# Altium schematic sheet Boost Convertor V2 Schematic.SchDoc
size A4; SheetNumber: 1; SheetTotal: 1
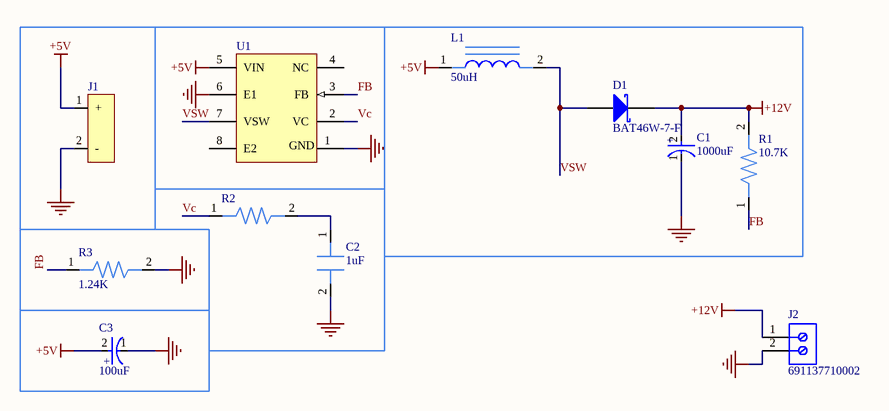
[diagram p0: Boost Convertor V2 Schematic.SchDoc]

## Parts
C1  value 1000uF  [25PX1000MEFCT810X16]  (hidden comment: 16ZLH1000MEFC10X16)
C2  value 1uF  [C1210C105K5RACTU]  (hidden comment: CL10B105KA8NNNC)
C3  value 100uF  [35ZLH100MEFC6.3X11]  (hidden comment: 35ZLH100MEFC6.3X11)
D1  BAT46W-7-F  [DIOD-SOD-123-2_V]
J1  0022013037  (value not drawn)
J2  691137710002  [691137710002]
L1  value 50uH  [CTX50-1-52-R]  (hidden comment: CTX50-1-52-R)
R1  value 10.7K  [RC0805FR-0710K7L]  (hidden comment: RC0805FR-0710K7L)
R2  (no value)  [RC0805FR-071KL]
R3  value 1.24K  [RC0805FR-071K24L]  (hidden comment: RC0805FR-071K24L)
U1  LT1172CN8#PBF  [LT1172CN8#PBF-ND]  (value not drawn)

## Nets
+5V: C3.2(A) J1.1(+) L1.1 U1.5(VIN)
+12V: C1.2(A) D1.2(K) J2.1 R1.2
GND: C1.1(C) C2.2 C3.1(C) J1.2(-) J2.2 R3.2 U1.6(E1)
FB: R1.1 R3.1 U1.3(FB)
Vc: R2.1 U1.2(VC)
VSW: D1.1(A) L1.2 U1.7(VSW)
NetC2_1: C2.1 R2.2

Not connected (* = marked no-connect by the designer): U1 1(GND) 4(NC) 8(E2)

## Notes on the sheet
- (in symbol 16ZLH1000MEFC10X16) +
- (in symbol a00bbbee19879c290e62620ae7e47b1) +

## Library data of the parts
C1 = 16ZLH1000MEFC10X16: Aluminum Electrolytic Capacitor, Polarized, Aluminum (wet), 16V, 20% +Tol, 20% -Tol, 1000uF, Through Hole Mount; Manufacturer: Rubycon; Manufacturer Series: ZLH; Dielectric Material: Aluminium; Leakage Current: 160uA; Ripple Current: 1.056A; Tan Delta: 0.16; Supplier: Digikey; Supplier Part Number: 1189-1147-ND; Manufacturer Part Number: 16ZLH1000MEFC10X16; RoHS: Yes; Category: Aluminum Electrolytic Capacitors; Stock: 32532; Pricing: 1=0.61, 10=0.377, 50=0.2812, 100=0.2505, 500=0.19778, 1000=0.18113, 3000=0.16029, 5000=0.1525 (USD); Mounting Technology: Through Hole; Pins: 2; Package Shape: Cylindrical; Min Operating Temperature: -40°C; Max Operating Temperature: 105°C; Polarity: Polarized; Capacitor Type: Aluminium; Tolerance  (fill in as +-): 20%; Package Style: RadialMeter; Packaging: Bulk; Tolerance (fill in as +-): 20%; Rated DC Voltage (URdc): 16V; Termination: Wire; Diameter: 10mm; Length: 16mm; Terminal Pitch: 5mm; Reach SVHC Compliant: Yes; RoHS Compliant: Yes; ComponentLink1URL: https://datasheet.ciiva.com:443/pdfs/VipMasterIC/IC/RUBY/RUBYS01453/RUBYS01453-1.pdf?src-supplier=IHS+Markit; ComponentLink1Description: https://datasheet.ciiva.com:443/pdfs/VipMasterIC/IC/RUBY/RUBYS01453/RUBYS01453-1.pdf?src-supplier=IHS+Markit; ComponentLink2URL: https://datasheet.ciiva.com/6300/e-zlh-6300460.pdf?src-supplier=Digikey; ComponentLink2Description: https://datasheet.ciiva.com/6300/e-zlh-6300460.pdf?src-supplier=Digikey; ComponentLink3URL: https://datasheet.ciiva.com/11692/e-zlh-11692166.pdf?src-supplier=Avnet; ComponentLink3Description: https://datasheet.ciiva.com/11692/e-zlh-11692166.pdf?src-supplier=Avnet; ComponentLink4URL: https://datasheet.ciiva.com/16313/e-zlh-16313390.pdf?src-supplier=Future+Electronics; ComponentLink4Description: https://datasheet.ciiva.com/16313/e-zlh-16313390.pdf?src-supplier=Future+Electronics; ComponentLink5URL: https://datasheet.ciiva.com/22732/1910927-22732477.pdf?src-supplier=Element14; ComponentLink5Description: https://datasheet.ciiva.com/22732/1910927-22732477.pdf?src-supplier=Element14
C2 = CL10B105KA8NNNC: Ceramic Capacitor 1uF; Manufacturer: KEMET; Manufacturer Part Number: ESL105M100AC3AA; Capacitor Type: Aluminium; Supplier: Digikey; Supplier Part Number: 399-15737-ND; RoHS: Yes; Stock: 14632; Pricing: 1=0.15, 10=0.095, 50=0.0708, 100=0.0633, 500=0.04972, 1000=0.04522, 2500=0.04024, 5000=0.03706 (USD); Pins: 2; Reach SVHC Compliant: Yes; RoHS Compliant: Yes; ComponentLink1URL: https://datasheet.ciiva.com:443/pdfs/VipMasterIC/IC/KEME/KEME-S-A0008958449/KEME-S-A0008958449-1.pdf?src-supplier=IHS+Markit; ComponentLink1Description: https://datasheet.ciiva.com:443/pdfs/VipMasterIC/IC/KEME/KEME-S-A0008958449/KEME-S-A0008958449-1.pdf?src-supplier=IHS+Markit; ComponentLink2URL: https://api.kemet.com/component-edge/download/datasheet/ESL105M100AC3AA.pdf?src-supplier=Digikey; ComponentLink2Description: https://api.kemet.com/component-edge/download/datasheet/ESL105M100AC3AA.pdf?src-supplier=Digikey; ComponentLink3URL: https://datasheet.octopart.com/ESL105M100AC3AA-KEMET-datasheet-176335207.pdf?src-supplier=Newark; ComponentLink3Description: https://datasheet.octopart.com/ESL105M100AC3AA-KEMET-datasheet-176335207.pdf?src-supplier=Newark; Supplier 1: Avnet; Supplier Part Number 1: CL10B105KA8NNNC
C3 = a00bbbee19879c290e62620ae7e47b1: CAP ALUM 100UF 20% 35V RADIAL; Lead Diameter: 0.5mm; Leakage Current: 3uA; Ripple Current (AC): 540mA; Life (Hours): 6000Hour; Dielectric Material: Aluminium; Impedance: 94mR; Number of Pins: 2; Voltage: 35V; Case/Package: Radial; Min Operating Temperature: -40°C; Height - Seated (Max): 0.492inch; Height: 11mm; Tolerance: 20%; REACH SVHC: No SVHC; Series: ZLH; Radiation Hardening: No; Ripple Current: 540mA; Package Quantity: 2000; Max Operating Temperature: 105°C; Lead Pitch: 2.5mm; Termination: Radial; Voltage Rating: 35V; Diameter: 6.3mm; Packaging: Bulk; Construction: RADIAL; Voltage Rating (DC): 35V; Mount: Through Hole; RoHS Compliant: Yes; Capacitance: 100uF
D1 = CMP-0303-00004-1: Surface Mount Schottky Barrier Diode, 100 V, -55 to 125 degC, 2-Pin SOD123, RoHS, Tape and Reel; Manufacturer: Diodes Inc; IR@1.5 V: 0.3 uA Max.; V(BR)R: 100 V Min.; VF@10 mA: 0.45 V Max.; CT@1 V: 12 pF Typ.; PartNumber: BAT46W-7-F; ComponentLink1URL: http://www.diodes.com/; ComponentLink3URL: http://diodes.com/datasheets/ds30044.pdf; PackageDescription: 2-Pin SMD, Body 2.7 x 1.55 mm, Height 1.45 mm; ComponentLink2Description: Datasheet; ComponentLink3Description: Package Specification; Mounting Technology: Surface Mount; ComponentLink1Description: Manufacturer URL; RoHS: TRUE; Operating Temperature: -55 to 125 degC; Packing: Tape and Reel; ComponentLink2URL: http://diodes.com/datasheets/ds30044.pdf; DatasheetVersion: Rev. 16-2
J1 = Molex Connector
J2 = CMP-1502-03324-2: NexarPartId: 78871135; Voltage Rating: 300V; Number of Contacts: 2; Current Rating: 16A; Lead Pitch: 5mm; Height: 11.6mm; Packaging: Box; RoHS: Non-Compliant; Contact Material: Nickel, Tin; Max Operating Temperature: 120°C; Number of Pins: 2; Min Operating Temperature: -30°C; Number of Rows: 1
L1 = CTX50-1-52-R: General Purpose Inductor, 50uH, 1 Element, Iron-Core; Manufacturer: Eaton Cooper; Core Material: Ferrite; DC Resistance (DCR): 71.5mR; Inductor Application: POWER INDUCTOR; Channels: 1; Max Current Rating: 2.6A; Shape/Size Description: CYLINDRICAL PACKAGE; Shielding: Unshielded; Surface Mount: No; Lead Diameter: 0.58mm; Lead Length: 10mm; Package Diameter: 16.2mm; Package Length: 9mm; Supplier: Digikey; Supplier Part Number: 513-1108-ND; Manufacturer Part Number: CTX50-1-52-R; RoHS: Yes; Category: Fixed Inductors; Stock: 1049; Pricing: 1=2.67, 10=2.196, 25=2.0312, 50=1.915, 100=1.8057, 300=1.6451, 600=1.55137, 1200=1.46311, 2700=1.36639 (USD); Pins: 2; Min Operating Temperature: -40°C; Max Operating Temperature: 75°C; Construction: Vertical Mount; Inductance-Nom (L): 50uH; Inductor Type: GENERAL PURPOSE INDUCTOR; Package Style: ToroidalMeter; Packaging: Bulk; Terminal Placement: Radial; Termination: Wire; Lead Pitch: 7.5mm; Reach SVHC Compliant: Yes; RoHS Compliant: Yes; ComponentLink1URL: https://datasheet.ciiva.com:443/pdfs/VipMasterIC/IC/ETON/ETON-S-A0008259577/ETON-S-A0008259577-1.pdf?src-supplier=IHS+Markit; ComponentLink1Description: https://datasheet.ciiva.com:443/pdfs/VipMasterIC/IC/ETON/ETON-S-A0008259577/ETON-S-A0008259577-1.pdf?src-supplier=IHS+Markit; ComponentLink2URL: https://datasheet.ciiva.com/8005/705007-8005134.pdf?src-supplier=Element14; ComponentLink2Description: https://datasheet.ciiva.com/8005/705007-8005134.pdf?src-supplier=Element14; ComponentLink3URL: https://datasheet.ciiva.com/16430/bus-elx-ds-pm4304-lpci-series-16430805.pdf?src-supplier=Future+Electronics; ComponentLink3Description: https://datasheet.ciiva.com/16430/bus-elx-ds-pm4304-lpci-series-16430805.pdf?src-supplier=Future+Electronics; ComponentLink4URL: https://datasheet.ciiva.com/30168/4935b080188143dbb73de2176f2c5e73-30168168.pdf?src-supplier=Onlinecomponents.com; ComponentLink4Description: https://datasheet.ciiva.com/30168/4935b080188143dbb73de2176f2c5e73-30168168.pdf?src-supplier=Onlinecomponents.com
R1 = RC0805FR-0710K7L: Fixed Resistor, Metal Film, 0.25W, 10700ohm, 250V, 1% +/-Tol, -100,100ppm/Cel; Manufacturer: Yageo; Manufacturer Part Number: MFR-25FBF52-10K7; Supplier: Digikey; Supplier Part Number: 10.7KXBK-ND; RoHS: Yes; Category: Through-Hole Resistors; Stock: 6622; Pricing: 1=0.1, 10=0.039, 25=0.0328, 50=0.0286, 100=0.0251, 250=0.02128, 500=0.0189, 1000=0.01685, 5000=0.01321 (USD); ComponentLink1URL: https://datasheet.ciiva.com:443/pdfs/VipMasterIC/IC/YAGO/YAGO-S-A0009358480/YAGO-S-A0009358480-1.pdf?src-supplier=IHS+Markit; ComponentLink1Description: https://datasheet.ciiva.com:443/pdfs/VipMasterIC/IC/YAGO/YAGO-S-A0009358480/YAGO-S-A0009358480-1.pdf?src-supplier=IHS+Markit; ComponentLink2URL: https://datasheet.ciiva.com/25645/yageolr-mfr-2013-25645816.pdf?src-supplier=Digikey; ComponentLink2Description: https://datasheet.ciiva.com/25645/yageolr-mfr-2013-25645816.pdf?src-supplier=Digikey; Supplier 1: Digikey; Supplier Part Number 1: 311-10.7KCRCT-ND
R2 = RC0805FR-071KL: Fixed Resistor, Carbon Film, 0.25W, 1000ohm, 350V, 5% +/-Tol, -400,0ppm/Cel, Through Hole Mount; Manufacturer: Stackpole Electronics; Manufacturer Part Number: CF14JT1K00; Power: 250mW; Rated Temperature: 70°C; Value: 1kR; Temperature Coefficient (ppm/Cel): 400; Lead Diameter: 0.55mm; Lead Length: 28mm; Package Length: 6mm; Supplier: Digikey; Supplier Part Number: CF14JT1K00CT-ND; RoHS: Yes; Category: Through-Hole Resistors; Stock: 444805; Pricing: 1=0.1, 10=0.026, 25=0.022, 50=0.0192, 100=0.0169, 250=0.01424, 500=0.0126, 1000=0.0112 (USD); Mounting Technology: Through Hole; Pins: 2; Package Shape: Tubular; Terminal Finish: Tin; Min Operating Temperature: -55°C; Max Operating Temperature: 155°C; Tolerance: 5%; JESD-609 Code: e3; Resistor Type: FIXED RESISTOR; Construction: Tubular; Package Style: AXIAL; Packaging: Tape and Reel; Technology: CARBON FILM; Termination: Wire; Working Voltage: 350V; Reach SVHC Compliant: Yes; RoHS Compliant: Yes; ComponentLink1URL: https://datasheet.ciiva.com:443/pdfs/VipMasterIC/IC/SEIE/SEIE-S-A0009883960/SEIE-S-A0009883960-1.pdf?src-supplier=IHS+Markit; ComponentLink1Description: https://datasheet.ciiva.com:443/pdfs/VipMasterIC/IC/SEIE/SEIE-S-A0009883960/SEIE-S-A0009883960-1.pdf?src-supplier=IHS+Markit; ComponentLink2URL: https://www.seielect.com/catalog/SEI-Packaging.pdf?src-supplier=Digikey; ComponentLink2Description: https://www.seielect.com/catalog/SEI-Packaging.pdf?src-supplier=Digikey; ComponentLink3URL: https://www.seielect.com/Catalog/SEI-CF_CFM.pdf?src-supplier=Digikey; ComponentLink3Description: https://www.seielect.com/Catalog/SEI-CF_CFM.pdf?src-supplier=Digikey; ComponentLink4URL: https://www.verical.com/server-webapp/html/getDatasheet?partID=360403&src-supplier=Verical; ComponentLink4Description: https://www.verical.com/server-webapp/html/getDatasheet?partID=360403&src-supplier=Verical; ComponentLink5URL: https://www.seielect.com/catalog/SEI-CF_CFM.pdf?src-supplier=Avnet; ComponentLink5Description: https://www.seielect.com/catalog/SEI-CF_CFM.pdf?src-supplier=Avnet; ComponentLink6URL: http://components.arrow.com/part/dataview/27620077S9848643N1174?src-supplier=Arrow+Electronics; ComponentLink6Description: http://components.arrow.com/part/dataview/27620077S9848643N1174?src-supplier=Arrow+Electronics; ComponentLink7URL: https://datasheet.octopart.com/CF14JT1K00-Stackpole-Electronics-datasheet-8360004.pdf?src-supplier=Future+Electronics; ComponentLink7Description: https://datasheet.octopart.com/CF14JT1K00-Stackpole-Electronics-datasheet-8360004.pdf?src-supplier=Future+Electronics; ComponentLink8URL: http://www.seielect.com/Catalog/SEI-CF_CFM.pdf?src-supplier=Future+Electronics; ComponentLink8Description: http://www.seielect.com/Catalog/SEI-CF_CFM.pdf?src-supplier=Future+Electronics; ComponentLink9URL: https://datasheet.octopart.com/CF14JT1K00-Stackpole-Electronics-datasheet-32780772.pdf?src-supplier=Electro+Sonic; ComponentLink9Description: https://datasheet.octopart.com/CF14JT1K00-Stackpole-Electronics-datasheet-32780772.pdf?src-supplier=Electro+Sonic; ComponentLink10URL: https://datasheet.octopart.com/CF14JT1K00-Stackpole-Electronics-datasheet-32780772.pdf?src-supplier=Master+Electronics; ComponentLink10Description: https://datasheet.octopart.com/CF14JT1K00-Stackpole-Electronics-datasheet-32780772.pdf?src-supplier=Master+Electronics; Supplier 1: Digikey; Supplier Part Number 1: 311-1.00KCRCT-ND
R3 = RC0805FR-071K24L: Fixed Resistor, Metal Film, 0.25W, 1240ohm, 250V, 1% +/-Tol, -100,100ppm/Cel; Manufacturer: Yageo; Manufacturer Part Number: MFR-25FBF52-1K24; Supplier: Digikey; Supplier Part Number: 1.24KXBK-ND; RoHS: Yes; Category: Through-Hole Resistors; Stock: 9531; Pricing: 1=0.1, 10=0.039, 25=0.0328, 50=0.0286, 100=0.0251, 250=0.02128, 500=0.0189, 1000=0.01685, 5000=0.01321 (USD); ComponentLink1URL: https://datasheet.ciiva.com:443/pdfs/VipMasterIC/IC/YAGO/YAGO-S-A0009358480/YAGO-S-A0009358480-1.pdf?src-supplier=IHS+Markit; ComponentLink1Description: https://datasheet.ciiva.com:443/pdfs/VipMasterIC/IC/YAGO/YAGO-S-A0009358480/YAGO-S-A0009358480-1.pdf?src-supplier=IHS+Markit; ComponentLink2URL: https://datasheet.ciiva.com/25646/yageolr-mfr-2013-25646123.pdf?src-supplier=Digikey; ComponentLink2Description: https://datasheet.ciiva.com/25646/yageolr-mfr-2013-25646123.pdf?src-supplier=Digikey; Supplier 1: Digikey; Supplier Part Number 1: 311-1.24KCRCT-ND
U1 = LT-LT1172-X8-8: 100 kHz, 1.25 A, High Efficiency Switching Regulator, 8-pin DIP (N8-8), 0 to 100 degC, Pb-Free; Manufacturer: Linear Technology; Number of Outputs: 1; Frequency Sync Range: 120kHz - 160kHz; Mounting Technology: Through Hole; PackageDescription: 8-Pin PDIP, Body 10.16 x 6.48 mm, Pitch 2.54 mm; DatasheetVersion: Rev. G; ComponentLink1Description: Manufacturer URL; RoHS: TRUE; ComponentLink3Description: Package Specification; PackageReference: N8-8; ComponentLink2Description: Datasheet; PackageVersion: Rev. I, 07/2011; PartNumber: LT1172CN8#PBF; ComponentLink3URL: http://www.linear.com/docs/en/packaging/05081510_I_N8.pdf; ComponentLink2URL: http://cds.linear.com/docs/en/datasheet/117012fg.pdf; ComponentLink1URL: http://www.linear.com/